# EAGLE design bk (EAGLE 5.11)
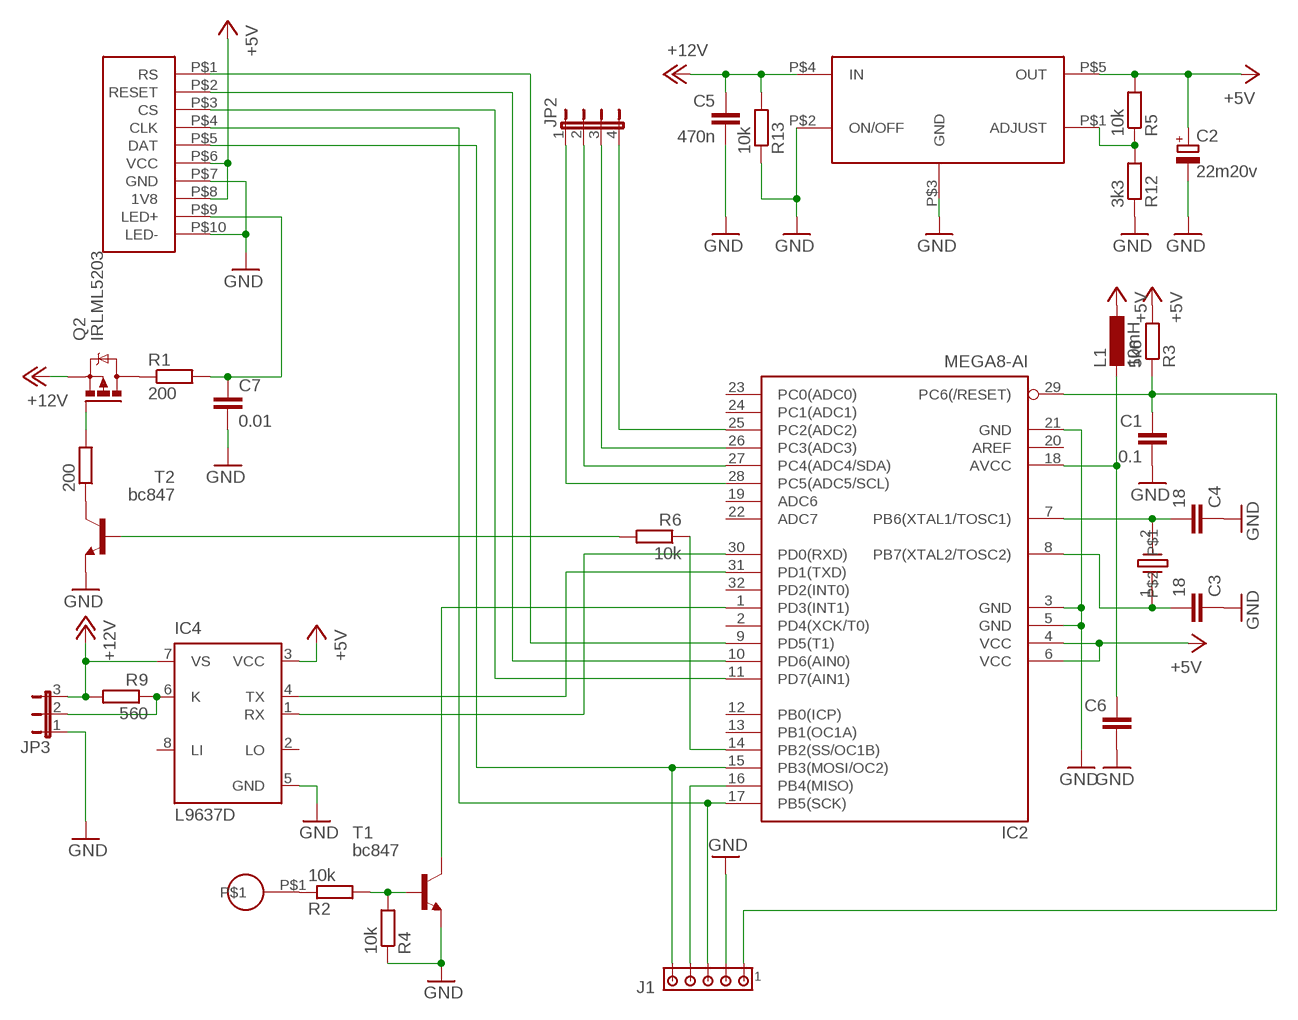
[diagram p0: schematic, sheet 1]

## Parts
200  R-EU_R0603  [R0603]
C1  0.1  C-EUC0603K  [C0603K]
C2  22m20v  CPOL-EU085CS-1AR  [085CS_1AR]
C3  18  C-EUC0603K  [C0603K]
C4  18  C-EUC0603K  [C0603K]
C5  470n  C-EUC0603K  [C0603K]
C6  C-EUC0603K  [C0603K]
C7  0.01  C-EUC0603K  [C0603K]
IC2  MEGA8-AI  [TQFP32-08]
IC4  L9637D  [SO08]
J1  MTA05-100  [10X05MTA]
JP2  JP4E  [JP4]
JP3  JP2E  [JP2]
L1  10mH  L-EUL3216C  [L3216C]
Q2  IRLML5203  [MICRO3]
R1  200  R-EU_R0603  [R0603]
R2  10k  R-EU_R0603  [R0603]
R3  5k6  R-EU_R0603  [R0603]
R4  10k  R-EU_R0603  [R0603]
R5  10k  R-EU_R0603  [R0603]
R6  10k  R-EU_R0603  [R0603]
R9  560  R-EU_R0603  [R0603]
R12  3k3  R-EU_R0603  [R0603]
R13  10k  R-EU_R0603  [R0603]
T1  bc847  BC817-16-NPN-SOT23-BEC  [SOT23-BEC]
T2  bc847  BC817-16-NPN-SOT23-BEC  [SOT23-BEC]
U$1  LM2941  [LM2941S]
U$2  16Mhz  NX3225SA  [NX3225SA]
U$3  PAD  [PAD]
U$4  LPH88XX  [LPH88XX]

## Nets
+5V: C2.+ IC2.4(VCC) IC2.6(VCC) IC4.3(VCC) L1.1 R3.2 R5.2 U$1.P$5(OUT) U$4.P$6(VCC) U$4.P$8(1V8)
+12V: C5.1 IC4.7(VS) JP3.3 Q2.2(S) R9.2 R13.2 U$1.P$4(IN)
GND: C1.2 C2.- C3.1 C4.1 C5.2 C6.2 C7.2 IC2.3(GND) IC2.5(GND) IC2.21(GND) IC4.5(GND) J1.2 JP3.1 R4.1 R12.1 R13.1 T1.E T2.E U$1.P$2(ON/OFF) U$1.P$3(GND) U$4.P$7(GND) U$4.P$10(LED-)
LCD_CS: IC2.11(PD7(AIN1)) U$4.P$3(CS)
LCD_RESET: IC2.10(PD6(AIN0)) U$4.P$2(RESET)
LCD_RS: IC2.9(PD5(T1)) U$4.P$1(RS)
LCLK: IC2.17(PB5(SCK)) J1.3 U$4.P$4(CLK)
LDAT_MOSI: IC2.15(PB3(MOSI/OC2)) J1.5 U$4.P$5(DAT)
MCU_RXD: IC2.30(PD0(RXD)) IC4.1(RX)
MCU_TXD: IC2.31(PD1(TXD)) IC4.4(TX)
MISO: IC2.16(PB4(MISO)) J1.4
N$1: IC4.6(K) JP3.2 R9.1
N$2: C7.1 R1.2 U$4.P$9(LED+)
N$3: IC2.14(PB2(SS/OC1B)) R6.1
N$4: C4.2 IC2.7(PB6(XTAL1/TOSC1)) U$2.2
N$5: Q2.3(D) R1.1
N$6: R6.2 T2.B
N$7: R2.2 R4.2 T1.B
N$8: R2.1 U$3.P$1
N$9: IC2.1(PD3(INT1)) T1.C
N$10: R5.1 R12.2 U$1.P$1(ADJUST)
N$12: 200.1 T2.C
N$13: 200.2 Q2.1(G)
N$16: C6.1 IC2.18(AVCC) L1.2
N$24: C3.2 IC2.8(PB7(XTAL2/TOSC2)) U$2.1
RST: C1.1 IC2.29(PC6(/RESET)) J1.1 R3.1
XM: IC2.27(PC4(ADC4/SDA)) JP2.2
XP: IC2.28(PC5(ADC5/SCL)) JP2.1
YM: IC2.25(PC2(ADC2)) JP2.4
YP: IC2.26(PC3(ADC3)) JP2.3
Unconnected: IC2.2(PD4(XCK/T0)) IC2.12(PB0(ICP)) IC2.13(PB1(OC1A)) IC2.19(ADC6) IC2.20(AREF) IC2.22(ADC7) IC2.23(PC0(ADC0)) IC2.24(PC1(ADC1)) IC2.32(PD2(INT0)) IC4.2(LO) IC4.8(LI)

## Library data of the parts
200 R1-R6 R9 R12 R13 = rcl:R-EU_: RESISTOR, European symbol
C1 C3-C7 = rcl:C-EU: CAPACITOR, European symbol
C2 = rcl:CPOL-EU: POLARIZED CAPACITOR, European symbol
IC2 = atmel:MEGA8: MICROCONTROLLER 8 Kbytes FLASH, 1 kbytes SRAM, 512 bytes EEPROM, USART, 6-channel 10 bit ADC, 2-channel 8 bit ADC Pin compatible with Atmega48, ATMega88, ATMega168 Source: avr.lbr; MPN: ATMEGA8-16AU; OC_FARNELL: 9171371; OC_NEWARK: 73M8863
IC4 = st-microelectronics:L9637D: ISO 9141 INTERFACE Source: 1765.pdf; MPN: L9637D; OC_FARNELL: unknown; OC_NEWARK: 56P8926
J1 = con-amp:MTA05-100: AMP connector; OC_FARNELL: unknown; OC_NEWARK: unknown
JP2 = jumper:JP4E: JUMPER
JP3 = jumper:JP2E: JUMPER
L1 = rcl:L-EU: INDUCTOR, European symbol
Q2 = transistor-power:IRLML5203: HEXFET P-Channel Power MOSFET
T1 T2 = transistor:*-NPN-: NPN Transistror BF959 corrected 2008.03.06
U$1 = my_analog:LM2941
U$2 = my_analog:NX3225SA
U$3 = my_analog:PAD
U$4 = my_analog:LPH88XX

## Board
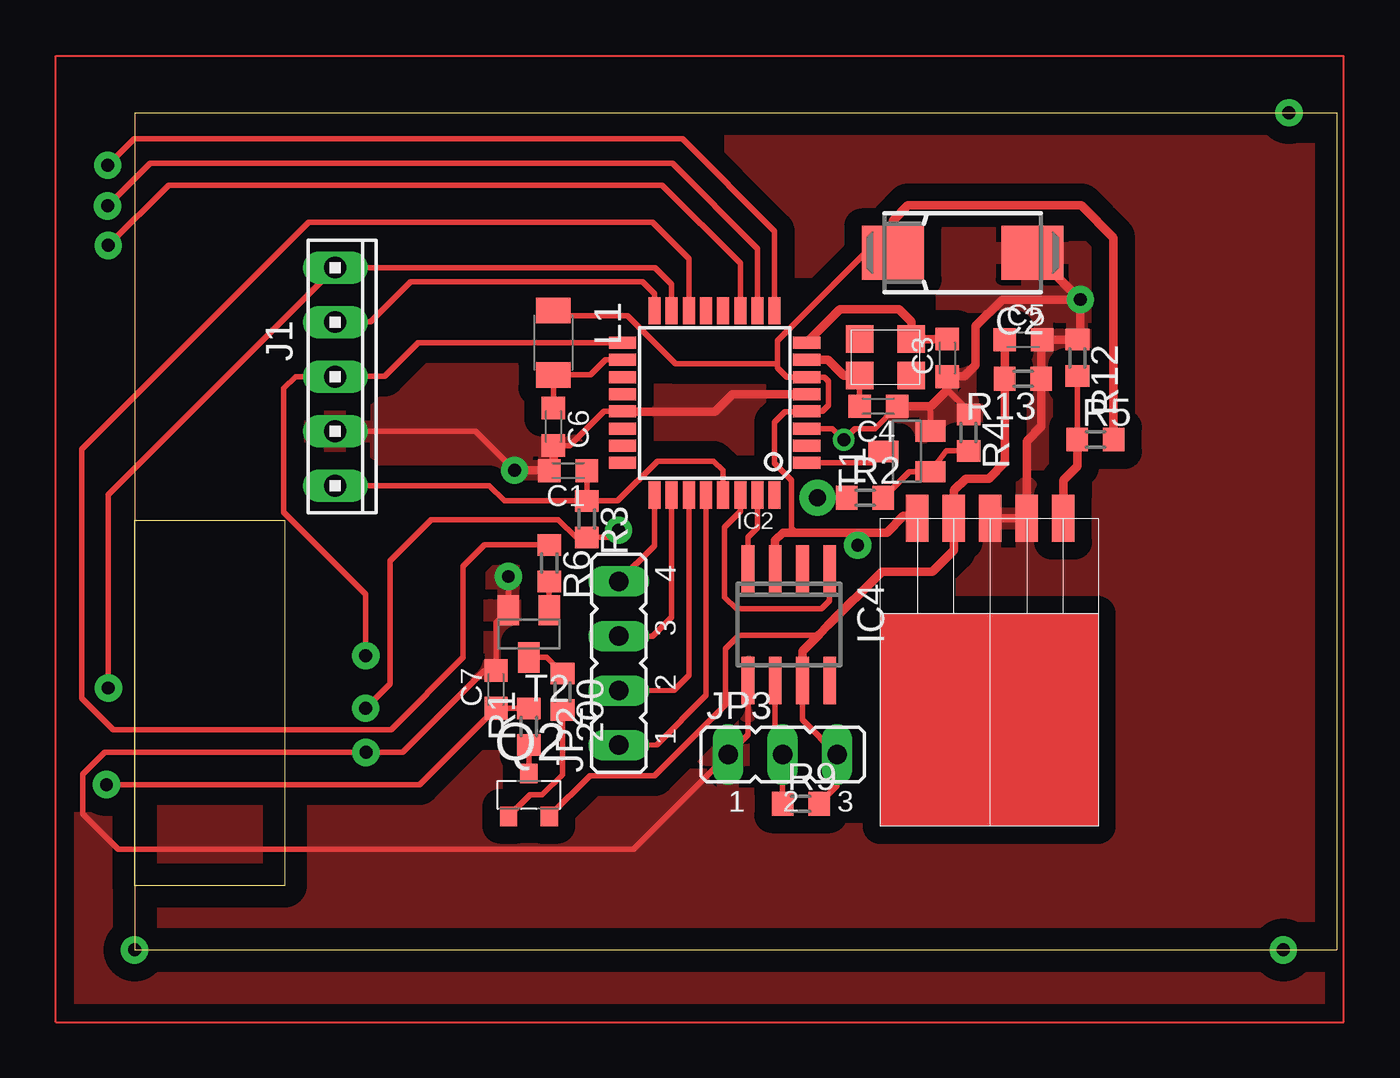
[diagram p1: board, top side]
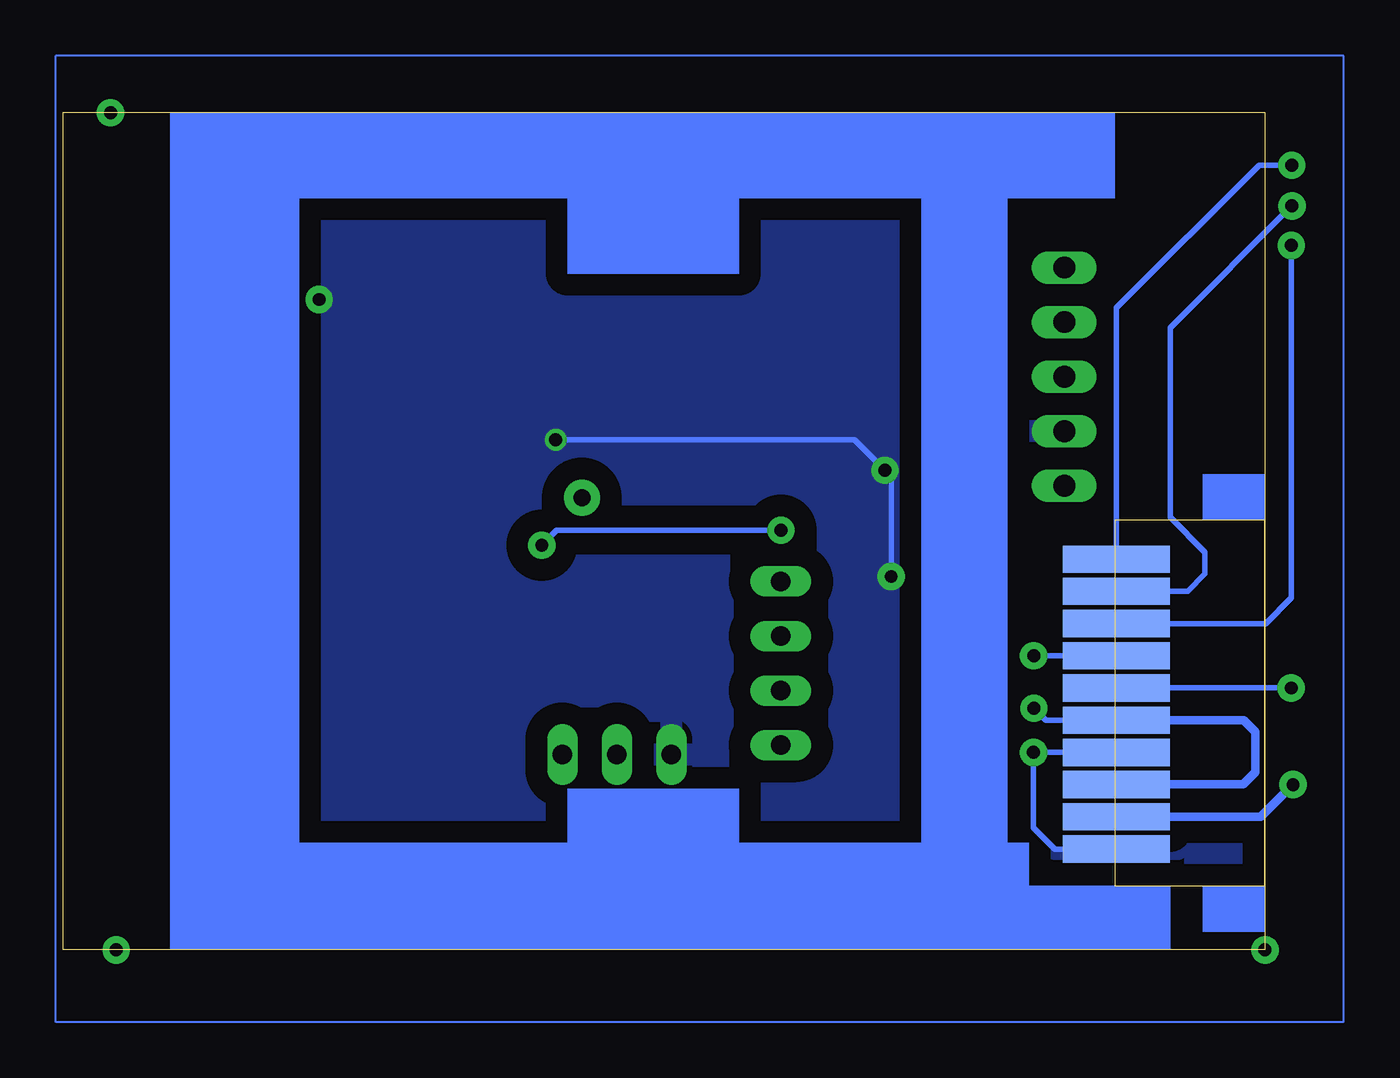
[diagram p2: board, bottom side, seen from below]

Size 56 x 39 mm. Coordinates in mm from the lower left corner, seen from the top.
Copper layers (1*16): Top 0.035mm / dielectric 1.5mm / Bottom 0.035mm
Design rules "default": minimum track width 10mil, minimum drill 24mil, track to track 8mil, track to pad 8mil, pad to pad 8mil, via to via 8mil, smd to smd 8mil, copper to edge 40mil, drill to drill 8mil, minimum pad ring 10mil, minimum via ring 8mil, stop-mask expansion 4mil, vias tented up to drill 0mil, thermal gap 10mil

### Footprints (pad centres in the part's own frame; a part is rotated, then mirrored left to right if it is on the bottom)
R0603 = smd 1 x 1.1: 1 -0.85,0; 2 0.85,0
C0603K = smd 1.05 x 1.08: 1 -0.875,0; 2 0.875,0
085CS_1AR = smd 2.9 x 2.5: + 3.25,0; - -3.25,0
TQFP32-08 = smd 1.27 x 0.559: 1 -4.293,2.8; 2 -4.293,2; 3 -4.293,1.2; 4 -4.293,0.4; 5 -4.293,-0.4; 6 -4.293,-1.2; 7 -4.293,-2; 8 -4.293,-2.8; 17 4.293,-2.8; 18 4.293,-2; 19 4.293,-1.2; 20 4.293,-0.4; 21 4.293,0.4; 22 4.293,1.2; 23 4.293,2; 24 4.293,2.8 | smd 0.559 x 1.27: 9 -2.8,-4.293; 10 -2,-4.293; 11 -1.2,-4.293; 12 -0.4,-4.293; 13 0.4,-4.293; 14 1.2,-4.293; 15 2,-4.293; 16 2.8,-4.293; 25 2.8,4.293; 26 2,4.293; 27 1.2,4.293; 28 0.4,4.293; 29 -0.4,4.293; 30 -1.2,4.293; 31 -2,4.293; 32 -2.8,4.293
SO08 = smd 0.6 x 2.2: 1 -1.905,-2.6; 2 -0.635,-2.6; 3 0.635,-2.6; 4 1.905,-2.6; 5 1.905,2.6; 6 0.635,2.6; 7 -0.635,2.6; 8 -1.905,2.6
10X05MTA = drill 1.016 long: 1 5.08,0; 2 2.54,0; 3 0,0; 4 -2.54,0; 5 -5.08,0
JP4 = drill 0.914 long: 1 -3.81,0; 2 -1.27,0; 3 1.27,0; 4 3.81,0
JP2 = drill 0.914 long: 1 -2.54,0; 2 0,0; 3 2.54,0
L3216C = smd 1.2 x 1.6: 1 -1.5,0; 2 1.5,0
MICRO3 = smd 0.8 x 0.9: 1 -0.95,-1; 2 0.95,-1; 3 0,1
SOT23-BEC = smd 1 x 1.4: B -0.95,-1.1; C 0,1.1; E 0.95,-1.1
LM2941S = smd 1.067 x 2.184: P$1 1.64,0; P$2 3.34,0; P$3 5.04,0; P$4 6.74,0; P$5 8.44,0
NX3225SA = smd 1.27 x 1.27: 1 0.4,0.4; 2 2.8,2.1; NC1 0.4,2.1; NC2 2.8,0.4
PAD = drill 0.8 pad 1.676 round: P$1 0,0
LPH88XX = smd 5 x 1.27 bottom: P$1 6.92,18.2; P$2 6.92,16.7; P$3 6.92,15.2; P$4 6.92,13.7; P$5 6.92,12.2; P$6 6.92,10.7; P$7 6.92,9.2; P$8 6.92,7.7; P$9 6.92,6.2; P$10 6.92,4.7

### Placement (x,y rotation side)
200  19.94,12.02 270 top
C1  20.2,22.32 180 top
C2  38.58,32.47 180 top
C3  37.86,27.57 90 top
C4  34.65,25.32 180 top
C5  41.41,28.42 0 top
C6  19.51,24.37 270 top
C7  16.84,12.13 90 top
IC2  27.02,25.48 180 top
IC4  30.48,15.15 180 top
J1  9.35,26.7 270 top
JP2  22.55,13.35 90 top
JP3  30.19,9.1 0 top
L1  19.5,28.28 270 top
Q2  18.37,7.22 0 top
R1  18.37,10.4 90 top
R2  34.03,21.06 0 top
R3  21.07,20.06 270 top
R4  38.85,24.09 270 top
R5  44.77,23.77 0 top
R6  19.32,18.01 270 top
R9  31.04,6.81 0 top
R12  43.92,27.57 270 top
R13  41.39,26.6 180 top
T1  35.98,23.22 90 top
T2  18.37,14.72 180 top
U$1  44.9,20.1 180 top
U$2  36.58,28.85 180 top
U$3  31.82,21.06 180 top
U$4  0,0 0 top

### Tracks (layer width: path | path; a pad name or v marks a point on that pad's centre or on a via)
+5V  (via drill 0.6 pad 1.27)
  Top 0.254: 36.44,20.08 U$1.P$5 36.35,20.21 | 29.96,27.22 29.96,28.37 34.06,32.47 | 29.96,27.22 29.96,27.12 30.4,26.68 IC2.6 31.32,26.67 32.15,26.67 32.33,26.49 32.33,25.37 32.05,25.09 IC2.4 30.31,25.07 29.82,24.58 29.82,22.67 30.61,21.88 30.61,19.64 30.81,19.44 | R5.2 | 34.06,32.47 34,32.47 | 34.06,32.47 C2.+ | 29.96,27.22 29.88,27.3 25.21,27.3 22.97,29.54 19.74,29.54 L1.1 | v10.76,11.26 11.9,12.4 11.9,18.13 13.81,20.04 19.73,20.04 20.56,19.21 R3.2 22.21,19.21 v22.55,19.55 | v33.69,18.85 33.69,19.43 33.7,19.44
  Top 0.406: R5.2 45.61,33.16 44.1,34.67 36.04,34.67 35.34,33.97 C2.+ | 36.35,20.21 35.81,20.21 35.04,19.44 33.7,19.44 30.81,19.44 30.2,19.44 29.84,19.08 IC4.3
  Bottom 0.254: U$4.P$6 10.2,10.7 v10.76,11.26 | v22.55,19.55 32.99,19.55 v33.69,18.85
  Bottom 0.406: U$4.P$6 0.99,10.7 0.45,10.16 0.45,8.27 1.01,7.71 U$4.P$8
+12V
  Top 0.254: U$1.P$4 38.14,20.12 | 31.86,14.66 28.16,14.66 27.53,14.02 27.53,11.41 24.23,8.11 21.21,8.11 Q2.2 | IC4.7 31.11,10.71 JP3.3 32.73,7.65 R9.2
  Top 0.406: C5.1 R13.2 40.54,22.71 39.81,21.95 38.72,21.95 38.17,21.4 U$1.P$4 38.16,18.61 37.17,17.62 34.81,17.62 32.29,15.1 31.91,14.7 31.86,14.66 31.12,13.91 IC4.7
GND  (via drill 0.6 pad 1.02, 0.6 pad 1.27)
  Top 0.254: C3.1 | U$1.P$3 39.84,20.12 | IC2.21 21.86,25.08 20.27,23.49 C6.2 | U$1.P$2 | T1.E 37.07,25.13 36.87,25.33 | R4.1 38.85,25.1 37.86,26.09 | J1.2 15.88,24.16 v17.7,22.34 | IC2.3 32.52,24.28 v33.04,23.76 v33.05,23.76 33.57,24.28 34.48,24.28 C4.1 | IC4.5 28.57,10.03 JP3.1 23.25,4.7 -0.77,4.7 -2.42,6.35 -2.42,8.18 -1.4,9.2 v10.78,9.2 12.48,9.2 16.28,13 C7.2 16.84,15.24 T2.E v17.42,17.39 v17.41,17.39
  Top 0.406: v44.06,30.29 40.43,30.29 39.18,29.04 39.18,27.24 38.66,26.72 37.88,26.72 C3.1 37.86,26.09 37.1,25.33 36.87,25.33 C4.1 | v44.06,30.29 44.06,28.56 R12.1 C5.2 42.24,28.38 R13.1 | IC2.21 22.75,25.06 27.04,25.06 27.86,25.88 IC2.5 | C2.- 41.88,32.47 v44.06,30.29 | 19.3,22.34 C1.2 | v17.7,22.34 19.3,22.34 | 19.3,22.34 19.51,22.55 C6.2 | R13.1 42.02,26.38 | R13.1 42.24,24.38 41.56,23.7 U$1.P$2 U$1.P$3
  Bottom 0.254: U$4.P$10 9.79,4.7 10.78,5.69 v10.78,9.2 U$4.P$7 | v33.04,23.76 19.12,23.76 v17.7,22.34 17.41,22.34 v17.41,17.39
  Bottom 0.406: U$4.P$10
  pour Top (isolate 0.813, rank 6): -3.67,41.71 56.27,41.71 56.27,-3.36 -3.67,-3.36
  pour Bottom (isolate 1.016): -3.67,-3.36 56.32,-3.36 56.32,41.63 -3.67,41.63
LCD_CS  (via drill 0.6 pad 1.27)
  Top 0.254: v-1.23,32.81 1.58,35.62 24.57,35.62 28.22,31.97 IC2.11
  Bottom 0.254: U$4.P$3 -0.03,15.2 -1.23,16.4 v-1.23,32.81
LCD_RESET  (via drill 0.6 pad 1.27)
  Top 0.254: IC2.10 29.03,29.78 29.03,31.49 29.03,31.81 29.03,32.65 25.05,36.63 0.72,36.63 v-1.26,34.65
  Bottom 0.254: U$4.P$2 3.6,16.71 2.8,17.51 2.8,18.53 4.41,20.14 4.41,28.98 v-1.26,34.65
LCD_RS  (via drill 0.6 pad 1.27)
  Top 0.254: v-1.25,36.54 -0.02,37.77 25.53,37.77 29.82,33.48 IC2.9
  Bottom 0.254: v-1.25,36.54 0.26,36.54 6.92,29.9 U$4.P$1
LCLK  (via drill 0.6 pad 1.27)
  Top 0.254: IC2.17 13.22,28.28 11.65,26.71 J1.3 7.5,26.7 6.95,26.15 6.95,20.39 10.77,16.57 v10.77,13.7
  Bottom 0.254: U$4.P$4 v10.77,13.7
LDAT_MOSI  (via drill 0.6 pad 1.27)
  Top 0.254: IC2.15 25.02,31 24.24,31.78 J1.5 -1.22,21.21 v-1.22,12.2
  Bottom 0.254: v-1.22,12.2 U$4.P$5
MCU_RXD
  Top 0.254: IC2.30 28.22,20.42 27.49,19.69 27.49,16.43 28.04,15.88 31.99,15.88 32.38,16.27 IC4.1
MCU_TXD
  Top 0.254: IC4.4 28.57,19.23 29.02,19.67 IC2.31
MISO
  Top 0.254: IC2.16 24.22,30.56 23.66,31.12 12.86,31.12 10.99,29.25 J1.4
N$1
  Top 0.254: IC4.6 29.84,9.45 JP3.2 R9.1
N$2  (via drill 0.6 pad 1.27)
  Top 0.254: R1.2 C7.1 13.28,7.7 v-1.31,7.7
  Bottom 0.406: U$4.P$9 0.19,6.2 v-1.31,7.7
N$3
  Top 0.254: IC2.14 25.82,32.19 24.12,33.89 8.11,33.89 -2.47,23.31 -2.47,11.73 -1,10.26 11.94,10.26 15.31,13.63 15.31,17.87 16.3,18.86 R6.1
N$4
  Top 0.254: C4.2 U$2.2 33.76,26.77
  Top 0.406: U$2.2 33.04,26.75 32.3,27.49 31.32,27.49 IC2.7
N$5
  Top 0.254: Q2.3 R1.1
N$6
  Top 0.254: T2.B R6.2
N$7
  Top 0.254: R4.2 37.83,23.24 T1.B 36.09,22.27 R2.2
N$8
  Top 0.254: U$3.P$1 R2.1
N$9
  Top 0.254: IC2.1 34.35,22.68 T1.C
N$10
  Top 0.254: R5.1 R12.2 | 43.28,20.08 U$1.P$1
  Top 0.406: R5.1 43.92,22.53 43.26,21.87 U$1.P$1
N$11  (via drill 0.6 pad 1.27)
  other vias: 0,0
N$12
  Top 0.254: T2.C 19.19,13.62 200.1
N$13
  Top 0.254: Q2.1 18.42,7.22 18.99,7.22 19.94,8.17 200.2
N$14
  Top 0.1: -3.67,-3.36 -3.67,41.64 56.33,41.64 56.33,-3.36 -3.67,-3.36
N$16
  Top 0.254: IC2.18 21.94,27.48 21.24,26.78 L1.2 C6.1
N$17
  Bottom 0.1: -3.67,-3.36 -3.67,41.64 56.33,41.64 56.33,-3.36 -3.67,-3.36
N$18  (via drill 0.6 pad 1.27)
  other vias: 53.78,38.99
N$23  (via drill 0.6 pad 1.27)
  other vias: 53.52,0
N$24
  Top 0.406: C3.2 U$2.1 36.18,29.26 35.6,29.84 32.87,29.84 IC2.8
RST
  Top 0.254: IC2.29 27.41,22.34 26.98,22.77 24.37,22.77 22.51,20.91 R3.1 | C1.1 R3.1 | J1.1 16.52,21.62 17.23,20.91 R3.1
XM
  Top 0.254: IC2.27 25.82,12.8 25.12,12.1 JP2.2
XP
  Top 0.254: IC2.28 26.62,11.85 24.33,9.56 JP2.1
YM
  Top 0.254: IC2.25 24.22,18.83 JP2.4
YP
  Top 0.254: IC2.26 25.02,15.5 24.13,14.61 JP2.3